# EAGLE design LCD and Keypad Arduino Uno Shield (EAGLE 9.6.2)
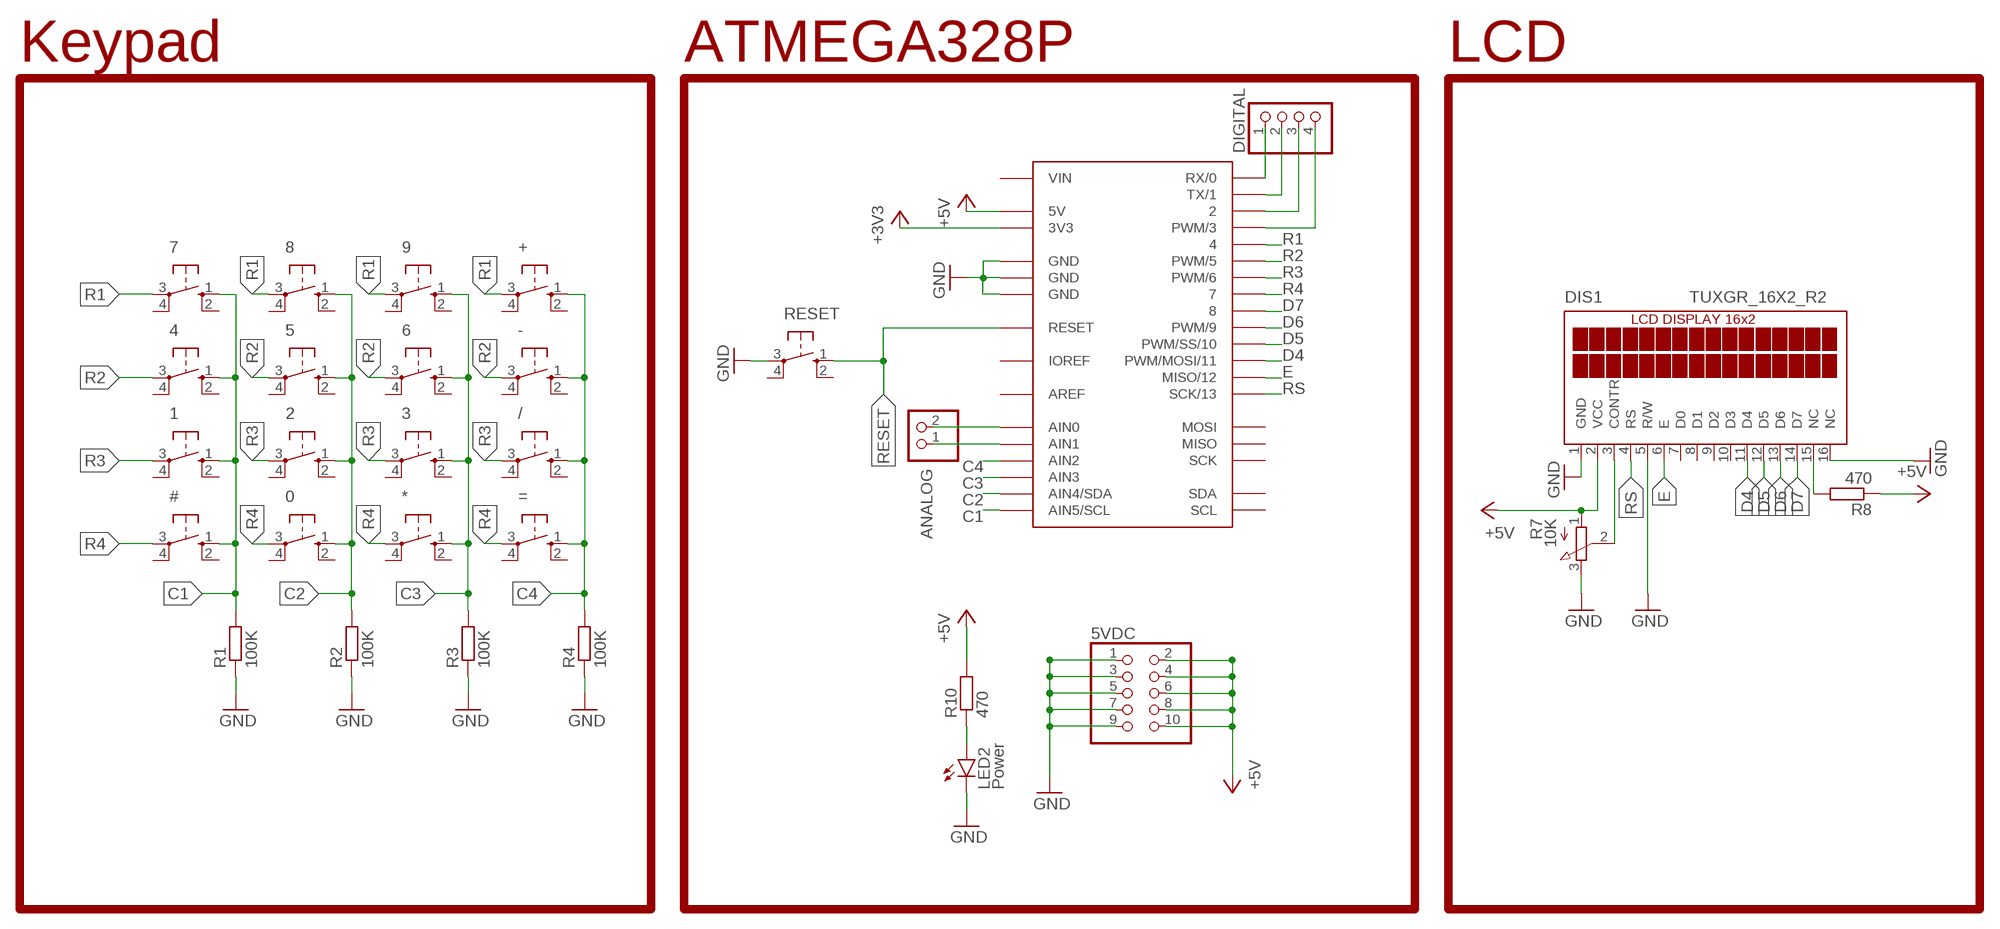
[diagram p0: schematic, sheet 1]

## Parts
0  10-XX  [B3F-10XX]
1  10-XX  [B3F-10XX]
2  10-XX  [B3F-10XX]
3  10-XX  [B3F-10XX]
4  10-XX  [B3F-10XX]
5  10-XX  [B3F-10XX]
5VDC  PINHD-2X5  [2X05]
6  10-XX  [B3F-10XX]
7  10-XX  [B3F-10XX]
8  10-XX  [B3F-10XX]
9  10-XX  [B3F-10XX]
#  10-XX  [B3F-10XX]
*  10-XX  [B3F-10XX]
+  10-XX  [B3F-10XX]
-  10-XX  [B3F-10XX]
/  10-XX  [B3F-10XX]
=  10-XX  [B3F-10XX]
ANALOG  PINHD-1X2  [1X02]
ARD1  A-UNO_ISP-TP  [A-UNO-ISP_TP]
DIGITAL  PINHD-1X4  [1X04]
DIS1  TUXGR_16X2_R2  [TUXGR_16X2_R2]
LED2  Power  LED3MM  [LED3MM]
R1  100K  R-EU_0204/7  [0204/7]
R2  100K  R-EU_0204/7  [0204/7]
R3  100K  R-EU_0204/7  [0204/7]
R4  100K  R-EU_0204/7  [0204/7]
R7  10K  3RP/1610N  [3RP/1610N]
R8  470  R-EU_0204/7  [0204/7]
R10  470  R-EU_0204/7  [0204/7]
RESET  10-XX  [B3F-10XX]

## Nets
+3V3: ARD1.3V3
+5V: 5VDC.2 5VDC.4 5VDC.6 5VDC.8 5VDC.10 ARD1.5V DIS1.2(VCC) R7.1(A) R8.1 R10.2
C1: 1.1(S) 4.1(S) 7.1(S) #.1(S) ARD1.A5(AIN5/SCL) R1.2
C2: 0.1(S) 2.1(S) 5.1(S) 8.1(S) ARD1.A4(AIN4/SDA) R2.2
C3: 3.1(S) 6.1(S) 9.1(S) *.1(S) ARD1.A3(AIN3) R3.2
C4: +.1(S) -.1(S) /.1(S) =.1(S) ARD1.A2(AIN2) R4.2
D4: ARD1.11(PWM/MOSI/11) DIS1.11(D4)
D5: ARD1.10(PWM/SS/10) DIS1.12(D5)
D6: ARD1.9(PWM/9) DIS1.13(D6)
D7: ARD1.8 DIS1.14(D7)
E: ARD1.12(MISO/12) DIS1.6(E)
GND: 5VDC.1 5VDC.3 5VDC.5 5VDC.7 5VDC.9 ARD1.GND@1(GND) ARD1.GND@2(GND) ARD1.GND@3(GND) DIS1.1(GND) DIS1.5(R/W) DIS1.16(NC) LED2.K(C) R1.1 R2.1 R3.1 R4.1 R7.3(E) RESET.3(P)
N$1: ANALOG.1 ARD1.A1(AIN1)
N$2: ANALOG.2 ARD1.A0(AIN0)
N$3: DIS1.3(CONTR) R7.2(S)
N$7: DIS1.15(NC) R8.2
N$8: ARD1.3(PWM/3) DIGITAL.4
N$9: ARD1.2 DIGITAL.3
N$10: ARD1.1(TX/1) DIGITAL.2
N$11: LED2.A R10.1
N$12: ARD1.0(RX/0) DIGITAL.1
R1: 7.3(P) 8.3(P) 9.3(P) +.3(P) ARD1.4
R2: 4.3(P) 5.3(P) 6.3(P) -.3(P) ARD1.5(PWM/5)
R3: 1.3(P) 2.3(P) 3.3(P) /.3(P) ARD1.6(PWM/6)
R4: 0.3(P) #.3(P) *.3(P) =.3(P) ARD1.7
RESET: ARD1.RST(RESET) RESET.1(S)
RS: ARD1.13(SCK/13) DIS1.4(RS)
Unconnected: 0.2(S1) 0.4(P1) 1.2(S1) 1.4(P1) 2.2(S1) 2.4(P1) 3.2(S1) 3.4(P1) 4.2(S1) 4.4(P1) 5.2(S1) 5.4(P1) 6.2(S1) 6.4(P1) 7.2(S1) 7.4(P1) 8.2(S1) 8.4(P1) 9.2(S1) 9.4(P1) #.2(S1) #.4(P1) *.2(S1) *.4(P1) +.2(S1) +.4(P1) -.2(S1) -.4(P1) /.2(S1) /.4(P1) =.2(S1) =.4(P1) ARD1.MISO ARD1.MOSI ARD1.SCK ARD1.SCL ARD1.SDA DIS1.7(D0) DIS1.8(D1) DIS1.9(D2) DIS1.10(D3) RESET.2(S1) RESET.4(P1)

## Notes on the sheet
- Keypad | ATMEGA328P | LCD

## Power pins joined to a net without a drawn wire
AREF: ARD1.AREF
IOREF: ARD1.IOREF
VIN: ARD1.VIN

## Library data of the parts
0 1-9 # * + - / = RESET = switch-omron:10-XX: OMRON SWITCH; MPN: B3F-1000; OC_FARNELL: 176432; OC_NEWARK: 36M3542
5VDC = pinhead:PINHD-2X5: PIN HEADER
ANALOG = pinhead:PINHD-1X2: PIN HEADER
ARD1 = Arduino:A-UNO_ISP
DIGITAL = pinhead:PINHD-1X4: PIN HEADER
DIS1 = display-lcd:TUXGR_16X2_R2: Tuxgraphics LCD display 16x2 characters reflective, without background light Source: tuxgr_12x2_r2.pdf; OC_FARNELL: unknown; OC_NEWARK: unknown
LED2 = led:LED: LED OSRAM: - CHIPLED LG R971, LG N971, LY N971, LG Q971, LY Q971, LO R971, LY R971 LH N974, LH R974 LS Q976, LO Q976, LY Q976 LO Q996 - Hyper CHIPLED LW Q18S LB Q993, LB Q99A, LB R99A - SideLED LS A670, LO A670, LY A670, LG A670, LP A670 LB A673, LV A673, LT A673, LW A673 LH A674 LY A675 LS A676, LA A676, LO A676, LY A676, LW A676 LS A679, LY A679, LG A679 - Hyper Micro SIDELED® LS Y876, LA Y876, LO Y876, LY Y876 LT Y87S - SmartLED LW L88C, LW L88S LB L89C, LB L89S, LG L890 LS L89K, LO L89K, LY L89K LS L896, LA L896, LO L896, LY L896 - TOPLED LS T670, LO T670, LY T670, LG T670, LP T670 LSG T670, LSP T670, LSY T670, LOP T670, LYG T670 LG T671, LOG T671, LSG T671 LB T673, LV T673, LT T673, LW T673 LH T674 LS T676, LA T676, LO T676, LY T676, LB T676, LH T676, LSB T676, LW T676 LB T67C, LV T67C, LT T67C, LS T67K, LO T67K, LY T67K, LW E67C LS E67B, LA E67B, LO E67B, LY E67B, LB E67C, LV E67C, LT E67C LW T67C LS T679, LY T679, LG T679 LS T770, LO T770, LY T770, LG T770, LP T770 LB T773, LV T773, LT T773, LW T773 LH T774 LS E675, LA E675, LY E675, LS T675 LS T776, LA T776, LO T776, LY T776, LB T776 LHGB T686 LT T68C, LB T68C - Hyper Mini TOPLED® LB M676 - Mini TOPLED Santana® LG M470 LS M47K, LO M47K, LY M47K Source: http://www.osram.convergy.de LUXEON: - LUMILED® LXK2-PW12-R00, LXK2-PW12-S00, LXK2-PW14-U00, LXK2-PW14-V00 LXK2-PM12-R00, LXK2-PM12-S00, LXK2-PM14-U00 LXK2-PE12-Q00, LXK2-PE12-R00, LXK2-PE12-S00, LXK2-PE14-T00, LXK2-PE14-U00 LXK2-PB12-K00, LXK2-PB12-L00, LXK2-PB12-M00, LXK2-PB14-N00, LXK2-PB14-P00, LXK2-PB14-Q00 LXK2-PR12-L00, LXK2-PR12-M00, LXK2-PR14-Q00, LXK2-PR14-R00 LXK2-PD12-Q00, LXK2-PD12-R00, LXK2-PD12-S00 LXK2-PH12-R00, LXK2-PH12-S00 LXK2-PL12-P00, LXK2-PL12-Q00, LXK2-PL12-R00 Source: www.luxeon.com KINGBRIGHT: KA-3528ASYC Source: www.kingbright.com
R1-R4 R8 R10 = rcl:R-EU_: RESISTOR, European symbol; SPICEPREFIX: R
R7 = pot:3RP/1610N: 16mm Potentiometer one level Source: http://www.alphapotentiometers.net/html/16mm_pot_2.html

## Board
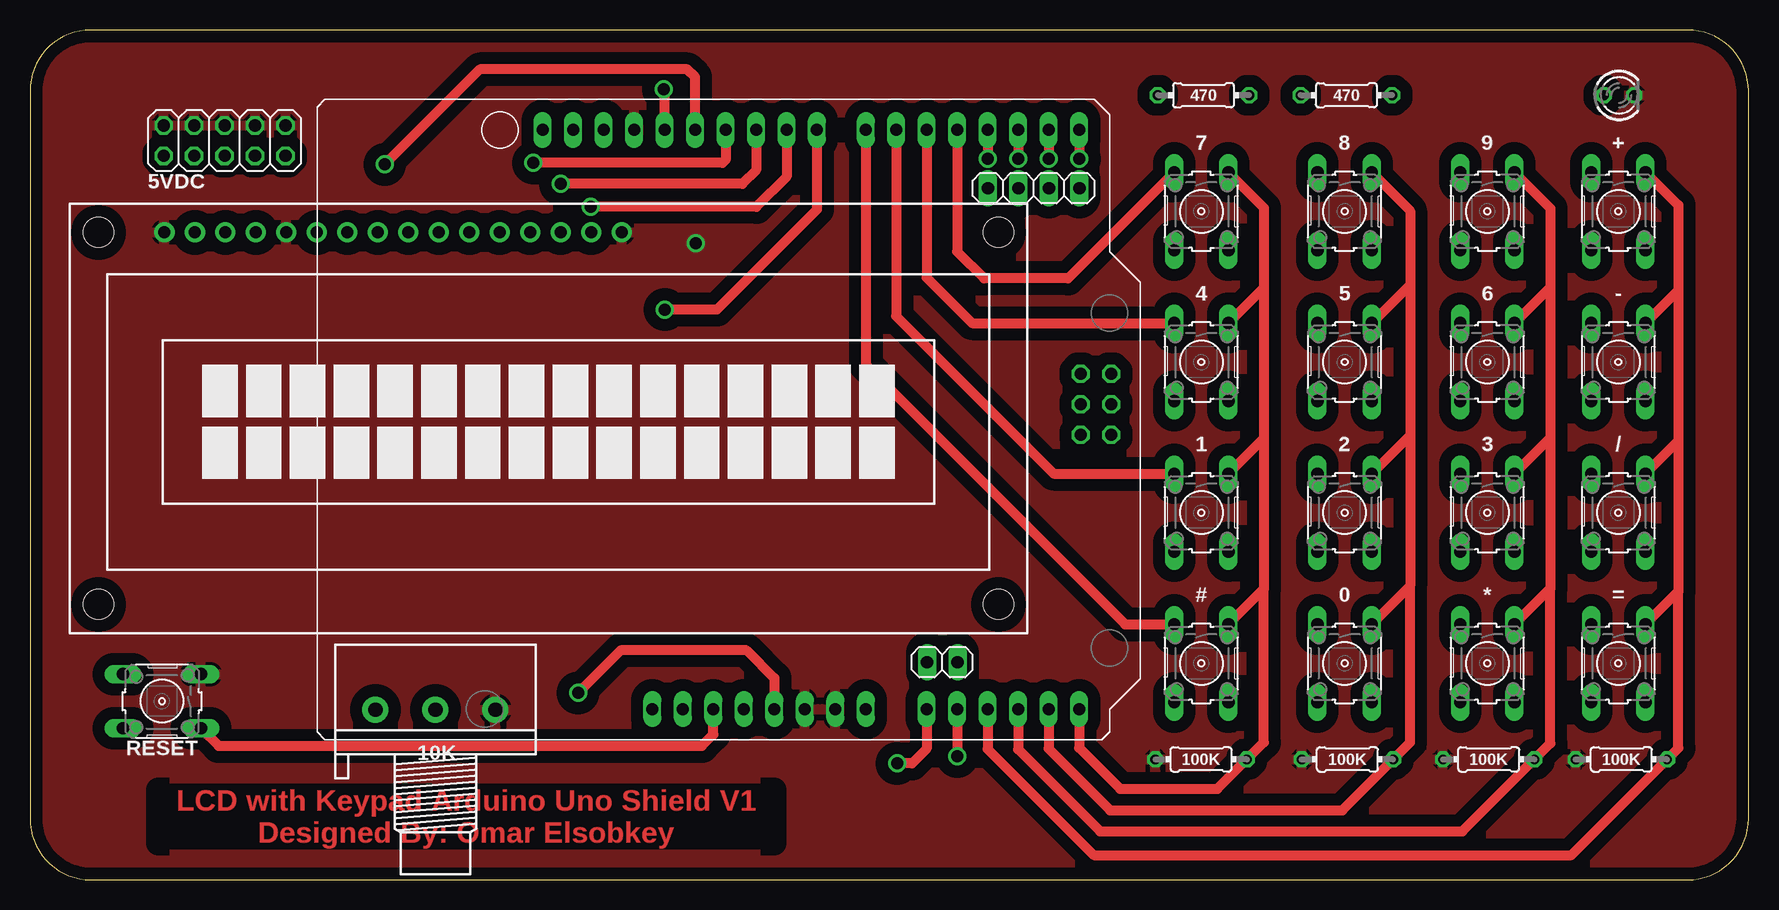
[diagram p1: board, top side]
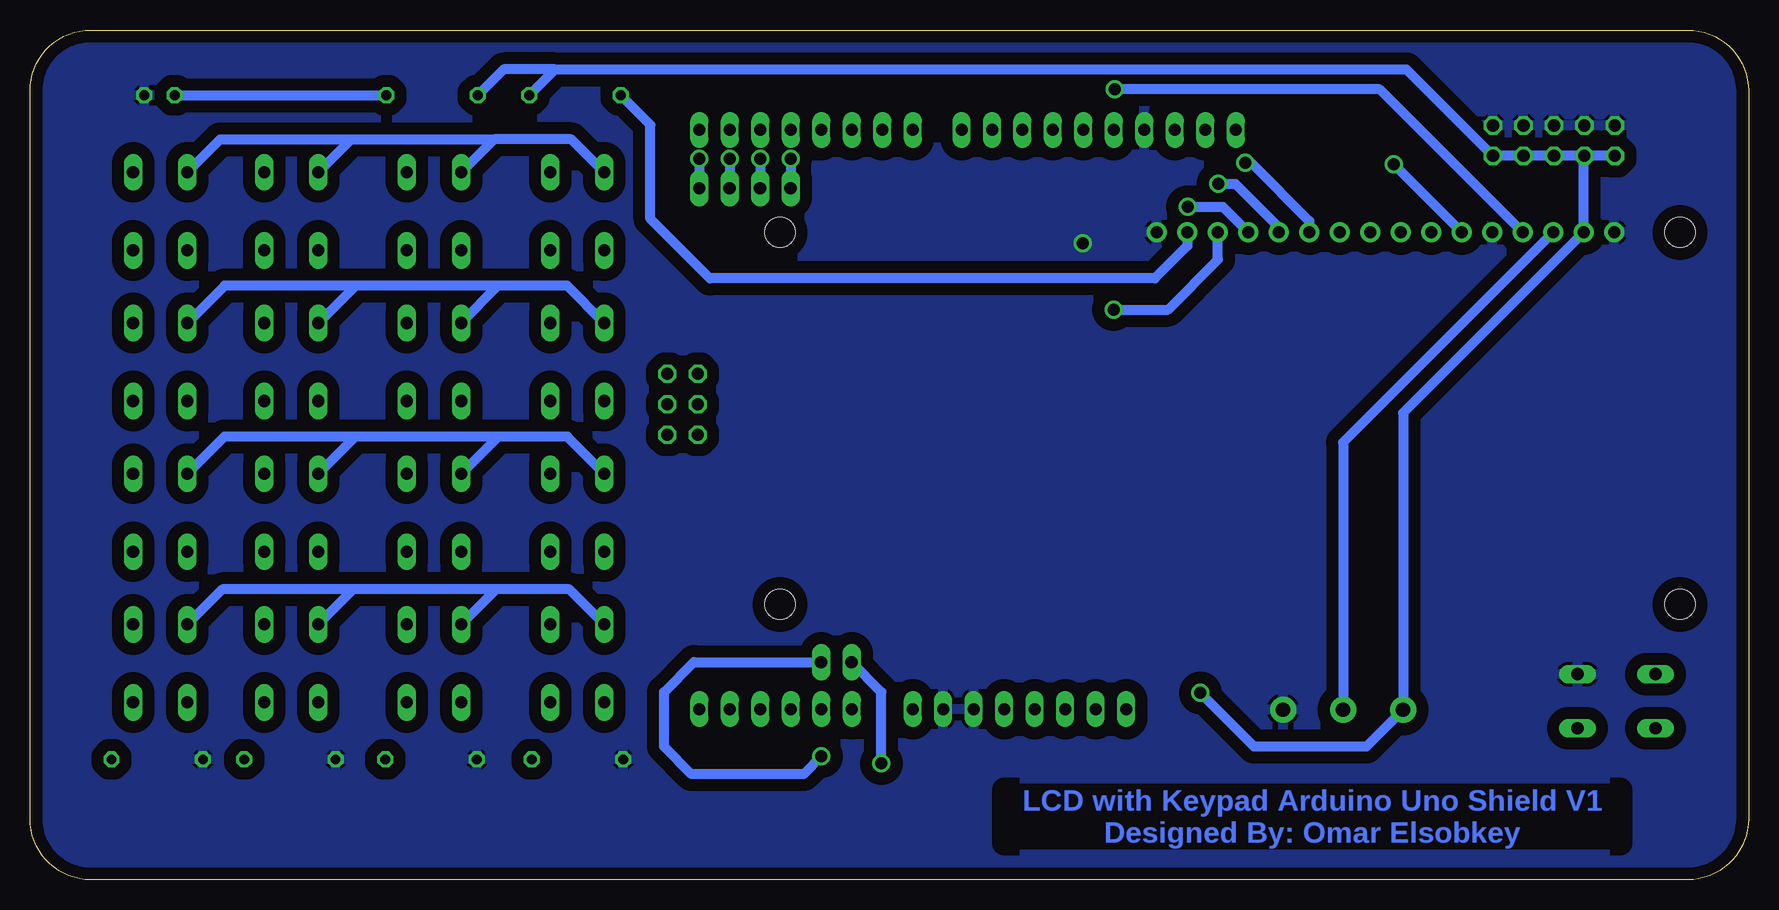
[diagram p2: board, bottom side, seen from below]

Size 143.21 x 70.82 mm. Coordinates in mm from the lower left corner, seen from the top.
Outline: 0,65.74 0,5.08 arc90 5.08,0 138.13,0 arc90 143.21,5.08 143.21,65.74 arc90 138.13,70.82 5.08,70.82 arc90 0,65.74
Copper layers (1*16): Top 0.035mm / dielectric 1.5mm / Bottom 0.035mm
Design rules "default *": minimum track width 32mil, minimum drill 0.35mm, track to track 16mil, track to pad 16mil, pad to pad 6mil, via to via 6mil, smd to smd 6mil, copper to edge 40mil, drill to drill 6mil, minimum pad ring 10mil, minimum via ring 8mil, stop-mask expansion 4mil, vias tented up to drill 0mil, thermal gap 10mil

### Footprints (pad centres in the part's own frame; a part is rotated, then mirrored left to right if it is on the bottom)
B3F-10XX = drill 1.016 long: 1 -3.251,2.261; 2 3.251,2.261; 3 -3.251,-2.261; 4 3.251,-2.261
2X05 = drill 1.016 octagon: 1 -5.08,-1.27; 2 -5.08,1.27; 3 -2.54,-1.27; 4 -2.54,1.27; 5 0,-1.27; 6 0,1.27; 7 2.54,-1.27; 8 2.54,1.27; 9 5.08,-1.27; 10 5.08,1.27
1X02 = drill 1.016 long: 1 -1.27,0; 2 1.27,0
A-UNO-ISP_TP = drill 1 long: 0 63.5,50.8; 1 60.96,50.8; 2 58.42,50.8; 3 55.88,50.8; 3V3 35.56,2.54; 4 53.34,50.8; 5 50.8,50.8; 5V 38.1,2.54; 6 48.26,50.8; 7 45.72,50.8; 8 41.656,50.8; 9 39.116,50.8; 10 36.576,50.8; 11 34.036,50.8; 12 31.496,50.8; 13 28.956,50.8; A0 50.8,2.54; A1 53.34,2.54; A2 55.88,2.54; A3 58.42,2.54; A4 60.96,2.54; A5 63.5,2.54; AREF 23.876,50.8; GND@1 40.64,2.54; GND@2 43.18,2.54; GND@3 26.416,50.8; IOREF 30.48,2.54; NC 27.94,2.54; RST 33.02,2.54; SCL 18.796,50.8; SDA 21.336,50.8; VIN 45.72,2.54 | drill 1 octagon: GND@4 66.167,25.4; MISO 63.627,30.48; MOSI 66.167,27.94; RST2 63.627,25.4; SCK 63.627,27.94; VCC 66.167,30.48
1X04 = drill 1.016 long: 1 -3.81,0; 2 -1.27,0; 3 1.27,0; 4 3.81,0
TUXGR_16X2_R2 = drill 1 pad 1.676: 1 -32,15.5; 2 -29.46,15.5; 3 -26.92,15.5; 4 -24.38,15.5; 5 -21.84,15.5; 6 -19.3,15.5; 7 -16.76,15.5; 8 -14.22,15.5; 9 -11.68,15.5; 10 -9.14,15.5; 11 -6.6,15.5; 12 -4.06,15.5; 13 -1.52,15.5; 14 1.02,15.5; 15 3.56,15.5; 16 6.1,15.5 | hole 2.5: -37.5,-15.5; 37.5,-15.5; -37.5,15.5; 37.5,15.5
LED3MM = drill 0.813 octagon: A -1.27,0; K 1.27,0
0204/7 = drill 0.813 octagon: 1 -3.81,0; 2 3.81,0
3RP/1610N = drill 1.2 pad 2.184: 1 -5,0; 2 0,0; 3 5,0

### Placement (x,y rotation side)
0  109.55,18.03 270 top
1  97.61,30.59 270 top
2  109.55,30.59 270 top
3  121.44,30.59 270 top
4  97.61,43.15 270 top
5  109.55,43.15 270 top
5VDC  16.22,61.6 180 top
6  121.44,43.15 270 top
7  97.61,55.7 270 top
8  109.55,55.7 270 top
9  121.44,55.7 270 top
#  97.61,18.03 270 top
*  121.44,18.03 270 top
+  132.36,55.7 270 top
-  132.36,43.15 270 top
/  132.36,30.59 270 top
=  132.36,18.03 270 top
ANALOG  76.02,18.14 180 top
ARD1  23.93,11.68 0 top
DIGITAL  83.64,57.63 180 top
DIS1  43.21,38.46 0 top
LED2  132.43,65.38 0 top
R1  97.59,10.03 0 top
R2  109.79,10.03 0 top
R3  121.56,10.03 0 top
R4  132.61,10.03 0 top
R7  33.78,14.17 0 top
R8  97.79,65.38 180 top
R10  109.7,65.38 180 top
RESET  11,14.88 180 top

### Tracks (layer width: path | path; a pad name or v marks a point on that pad's centre or on a via)
+5V  (via drill 1)
  Top 0.813: ARD1.5V 62.03,16.82 59.72,19.13 49.23,19.13 v45.67,15.57
  Bottom 0.813: v45.67,15.57 41.22,11.13 31.83,11.13 R7.1 28.78,38.92 DIS1.2 13.75,60.26 5VDC.8 | 5VDC.10 5VDC.8 | 5VDC.8 5VDC.6 5VDC.4 5VDC.2 28.51,67.54 99.44,67.54 | 99.44,67.54 R8.1 | 99.44,67.54 103.73,67.54 R10.2
C1
  Top 0.813: 7.1 102.82,56 102.82,49.35 | 102.82,49.35 4.1 | 102.82,49.35 102.82,36.79 | 102.82,36.79 1.1 | 102.82,36.79 102.82,24.24 | 102.82,24.24 #.1 | ARD1.A5 87.43,11 90.85,7.58 98.94,7.58 R1.2 102.82,11.46 102.82,24.24
C2
  Top 0.813: 8.1 115.01,55.75 115.01,49.6 | 115.01,49.6 5.1 | 115.01,49.6 115.01,37.05 | 115.01,37.05 2.1 | 115.01,37.05 115.01,24.49 | 115.01,24.49 0.1 | ARD1.A4 84.89,10.92 90.02,5.79 109.36,5.79 R2.2 115.01,11.45 115.01,24.49
C3
  Top 0.813: 9.1 126.7,55.96 126.7,49.39 | 126.7,49.39 6.1 | 126.7,49.39 126.7,36.83 | 126.7,36.83 3.1 | 126.7,36.83 126.7,24.28 | 126.7,24.28 *.1 | ARD1.A3 82.35,10.87 89.18,4.04 119.37,4.04 R3.2 126.7,11.36 126.7,24.28
C4
  Top 0.813: +.1 137.36,56.21 137.36,49.14 | -.1 137.36,49.14 | 137.36,49.14 137.36,36.58 | 137.36,36.58 /.1 | 137.36,36.58 137.36,24.02 | 137.36,24.02 =.1 | ARD1.A2 79.81,10.9 88.65,2.06 128.45,2.06 R4.2 137.36,10.97 137.36,24.02
D4  (via drill 1)
  Top 0.813: ARD1.11 57.96,60 57.71,59.74 v41.95,59.74
  Bottom 0.813: v41.95,59.74 41.45,59.74 36.61,54.9 DIS1.11
D5  (via drill 1)
  Top 0.813: v44.21,57.99 59.36,57.99 60.5,59.13 ARD1.10
  Bottom 0.813: v44.21,57.99 42.77,57.99 39.15,54.36 DIS1.12
D6  (via drill 1)
  Top 0.813: ARD1.9 63.04,58.6 60.53,56.08 v46.75,56.08
  Bottom 0.813: v46.75,56.08 43.81,56.08 DIS1.13
D7  (via drill 1)
  Top 0.813: ARD1.8 65.58,55.86 57.25,47.52 v52.91,47.52
  Bottom 0.813: v52.91,47.52 48.37,47.52 44.23,51.67 DIS1.14
E  (via drill 1)
  Top 0.813: ARD1.12 55.42,66.9 54.79,67.54 37.49,67.54 v29.57,59.61
  Bottom 0.813: v29.57,59.61 v29.56,59.61 DIS1.6
GND  (via drill 1)
  other vias: 55.47,53.06
  pour Bottom (isolate 1.016): -2.87,72.82 146.69,72.82 146.69,-2.18 -2.87,-2.18
  pour Top (isolate 1.016): -5.03,74.42 148.56,74.42 148.56,-4.57 -5.03,-4.57
N$1  (via drill 1)
  Top 0.813: ARD1.A1 v77.27,10.29
  Bottom 0.813: v77.27,10.29 78.74,8.81 88.09,8.81 90.37,11.1 90.37,15.65 87.88,18.14 ANALOG.1
N$2  (via drill 1)
  Top 0.813: ARD1.A0 74.73,10.92 73.51,9.7 v72.26,9.7
  Bottom 0.813: v72.26,9.7 72.26,15.65 ANALOG.2
N$3
  Bottom 0.813: DIS1.3 33.17,37.08 33.78,36.46 R7.2
N$7
  Bottom 0.813: DIS1.15 46.77,52.83 49.48,50.11 86.56,50.11 91.52,55.07 91.52,62.92 R8.2
N$8  (via drill 1)
  Top 0.813: ARD1.3 79.83,62.46 v79.83,60.07
  Bottom 0.813: v79.83,60.07 DIGITAL.4
N$9  (via drill 1)
  Top 0.813: ARD1.2 v82.35,60.07
  Bottom 0.813: v82.35,60.07 82.35,57.66 DIGITAL.3
N$10  (via drill 1)
  Top 0.813: ARD1.1 v84.89,60.07
  Bottom 0.813: v84.89,60.07 84.89,57.66 DIGITAL.2
N$11
  Bottom 0.813: LED2.A R10.1 | R10.1
N$12  (via drill 1)
  Top 0.813: ARD1.0 87.43,60.1 v87.45,60.07
  Bottom 0.813: v87.45,60.07 DIGITAL.1
NAMES
  pour Top (isolate 0.508): 12.07,9.17 60.45,9.17 60.45,1.45 12.07,1.45
  pour Bottom (isolate 0.508): 11.94,9.07 60.38,9.07 60.38,1.35 11.94,1.35
R1
  Top 0.813: ARD1.4 77.27,52.35 79.5,50.11 86.51,50.11 7.3
  Bottom 0.813: 7.3 98.09,61.7 104.54,61.7 | 8.3 104.54,61.7 | 116.46,61.67 116.44,61.7 104.54,61.7 | 116.46,61.67 9.3 | 116.46,61.67 | 116.46,61.67 127.39,61.67 +.3
R2
  Top 0.813: ARD1.5 74.73,50.19 78.52,46.4 4.3
  Bottom 0.813: 4.3 98.45,49.5 104.22,49.5 | 104.22,49.5 107.29,46.44 5.3 | 104.22,49.5 116.07,49.5 | 116.07,49.5 6.3 | 116.07,49.5 127,49.5 -.3
R3
  Top 0.813: ARD1.6 72.19,46.96 85.31,33.84 1.3
  Bottom 0.813: 1.3 98.44,36.93 104.2,36.93 | 104.2,36.93 2.3 | 104.2,36.93 116.09,36.93 | 116.09,36.93 3.3 | 116.09,36.93 127.01,36.93 /.3
R4
  Top 0.813: ARD1.7 69.65,42.9 91.26,21.29 #.3
  Bottom 0.813: #.3 98.27,24.21 104.36,24.21 | 0.3 104.36,24.21 | 104.36,24.21 116.26,24.21 | 116.26,24.21 *.3 | 116.26,24.21 127.18,24.21 =.3
RESET
  Top 0.813: RESET.1 15.72,11.15 55.98,11.15 56.95,12.12 ARD1.RST
RS  (via drill 1)
  Top 0.813: ARD1.13 52.88,65.79 v52.81,65.86
  Bottom 0.813: DIS1.4 30.73,65.86 v52.81,65.86

### Text on the board
Top: LCD with Keypad Arduino Uno Shield V1 / Designed By: Omar Elsobkey
Bottom: LCD with Keypad Arduino Uno Shield V1 / Designed By: Omar Elsobkey